# Altium schematic sheet MCUPower.SchDoc
size A3; SheetNumber: 3; SheetTotal: 6
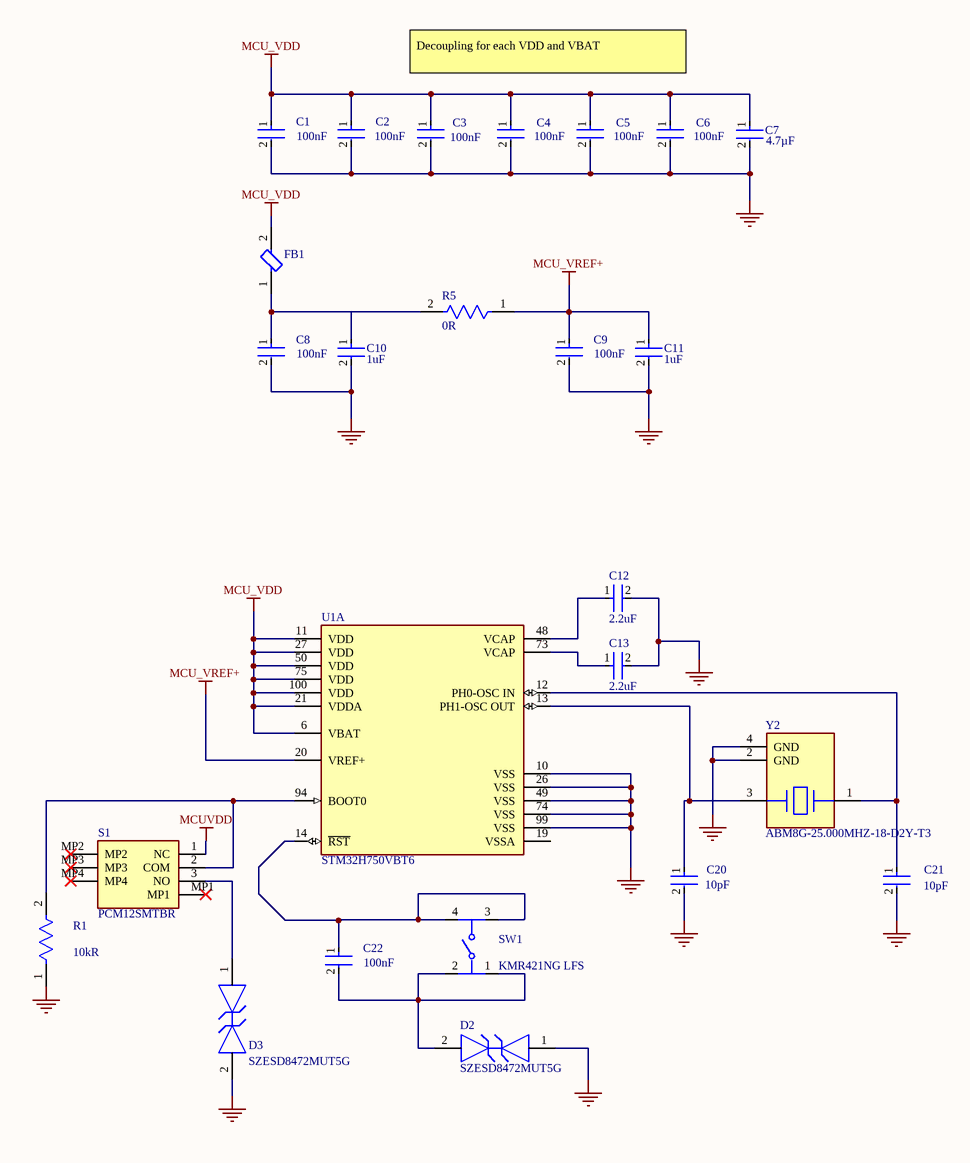
[diagram p0: MCUPower.SchDoc]

## Parts
C1  Capacitance: 100nF  [FP-GCM155-0_05-IPC_A]  (hidden comment: GCM155R71H104ME02J)
C2  Capacitance: 100nF  [FP-GCM155-0_05-IPC_A]  (hidden comment: GCM155R71H104ME02J)
C3  Capacitance: 100nF  [FP-GCM155-0_05-IPC_A]  (hidden comment: GCM155R71H104ME02J)
C4  Capacitance: 100nF  [FP-GCM155-0_05-IPC_A]  (hidden comment: GCM155R71H104ME02J)
C5  Capacitance: 100nF  [FP-GCM155-0_05-IPC_A]  (hidden comment: GCM155R71H104ME02J)
C6  Capacitance: 100nF  [FP-GCM155-0_05-IPC_A]  (hidden comment: GCM155R71H104ME02J)
C7  Capacitance: 4.7µF  [FP-GCM155-0_2-MFG]  (hidden comment: GCM155M8EB475ME08D)
C8  Capacitance: 100nF  [FP-GCM155-0_05-IPC_A]  (hidden comment: GCM155R71H104ME02J)
C9  Capacitance: 100nF  [FP-GCM155-0_05-IPC_A]  (hidden comment: GCM155R71H104ME02J)
C10  Capacitance: 1uF  [FP-GCM155-0_2-MFG]  (hidden comment: GCM155C71A105KE38D)
C11  Capacitance: 1uF  [FP-GCM155-0_2-MFG]  (hidden comment: GCM155C71A105KE38D)
C12  Capacitance: 2.2uF  [FP-GCH188-0_1-e0_2_0_5-MFG]  (hidden comment: GCM188C71A225KE02D)
C13  Capacitance: 2.2uF  [FP-GCH188-0_1-e0_2_0_5-MFG]  (hidden comment: GCM188C71A225KE02D)
C20  Capacitance: 10pF  [FP-GCM155-0_05-IPC_B]  (hidden comment: GCM1555G1H100GA16D)
C21  Capacitance: 10pF  [FP-GCM155-0_05-IPC_B]  (hidden comment: GCM1555G1H100GA16D)
C22  Capacitance: 100nF  [FP-GCM155-0_05-IPC_A]  (hidden comment: GCM155R71H104ME02J)
D2  SZESD8472MUT5G  [FP-152AF-MFG]
D3  SZESD8472MUT5G  [FP-152AF-MFG]
FB1  BLM15BX102SZ1D  [FP-BLM15-0_05-MFG]  (value not drawn)
R1  Resistance: 10kR  [FP-RC0402-0_4-IPC_A]  (hidden comment: RC0402FR-1310KL)
R5  Resistance: 0R  [FP-RMCF0402-MFG]  (hidden comment: RMCF0402ZT0R00)
S1  PCM12SMTBR  [PCM12SMTBR]
SW1  KMR421NG LFS  [FP-KMR421NG_LFS-MFG]
U1  STM32H750VBT6  [FP-LQFP100-1L-MFG]  (part A of 3)
Y2  ABM8G-25.000MHZ-18-D2Y-T3  [FP-ABM8G-MFG]

## Nets
GND: C1.2 C2.2 C3.2 C4.2 C5.2 C6.2 C7.2 C8.2 C9.2 C10.2 C11.2 C12.2 C13.2 C20.2 C21.2 D2.1 D3.2 R1.1 U1.10(VSS) U1.26(VSS) U1.49(VSS) U1.74(VSS) U1.99(VSS) Y2.2(GND) Y2.4(GND)
MCU_VDD: C1.1 C2.1 C3.1 C4.1 C5.1 C6.1 C7.1 FB1.2 U1.6(VBAT) U1.11(VDD) U1.21(VDDA) U1.27(VDD) U1.50(VDD) U1.75(VDD) U1.100(VDD)
MCU_VREF+: C9.1 C11.1 R5.1 U1.20(VREF+)
MCUVDD: S1.1(NC)
NetC8_1: C8.1 C10.1 FB1.1 R5.2
NetC12_1: C12.1 U1.48(VCAP)
NetC13_1: C13.1 U1.73(VCAP)
NetC20_1: C20.1 U1.13(PH1-OSC_OUT) Y2.3
NetC21_1: C21.1 U1.12(PH0-OSC_IN) Y2.1
NetC22_1: C22.1 SW1.3 SW1.4 U1.14(~{RST})
NetC22_2: C22.2 D2.2 SW1.1 SW1.2
NetD3_1: D3.1 S1.3(NO)
NetR1_2: R1.2 S1.2(COM) U1.94(BOOT0)

Not connected (* = marked no-connect by the designer): S1 MP1* MP2* MP3* MP4*; U1 19(VSSA)

## Notes on the sheet
- Decoupling for each VDD and VBAT

## Library data of the parts
C1-C6 C8 C9 C22 = CMP-06035-028957-1: Ceramic Capacitor for Automotive 100nF ±20% 50VDC X7R 0402 Paper T/R
C7 = CMP-00260-135863760-1: GCM155M8EB475ME08D Chip MultilayerCeramicCapacitors; Tolerance: 20%; Voltage Rating: 4V; Height: 700µm; Case/Package: 0402; NexarPartId: 135863760; Max Operating Temperature: 150°C; Material: Ceramic; Min Operating Temperature: -55°C; Lifecycle Status: Production
C10 C11 = CMP-06035-048986-1: CAP CER 1UF 10V X7S 0402; Tolerance: 10%; Min Operating Temperature: -55°C; Dielectric: X7S; Packaging: Tape and Reel; Ratings: AEC-Q200; Case Code (Metric): 1005; Max Operating Temperature: 125°C; Lead Free: Lead Free; Voltage Rating: 10V; Mount: Surface Mount; Width: 0.02inch; Depth: 0.5mm; Case/Package: 0402; Thickness: 0.022inch; Length: 0.039inch; Case Code (Imperial): 0402
C12 C13 = CMP-00260-57357036-1: GCM188C71A225KE02D Multilayer Ceramic Capacitor, 2.2 uF, 10 V, ± 10%, X7S, 0603 [1608 Metric]; NexarPartId: 57357036; RoHS: Non-Compliant; Lifecycle Status: Production
C20 C21 = CMP-06035-053638-1: Ceramic Capacitor for Automotive 10pF ±2% 50VDC X8G 0402 Paper T/R
D2 D3 = CMP-07200-000010-1: TVS DIODE 5.3V 14V 2X3DFN; Number of Bidirectional Channels: 1; Element Configuration: Single; Capacitance: 0.3pF; Peak Pulse Current: 3A; Power Line Protection: No; Min Breakdown Voltage: 7V; Direction: Bidirectional; Case/Package: DFN; Lead Free: Lead Free; Reverse Standoff Voltage: 5.3V; Clamping Voltage: 14V; Resistor Type: Zener; Packaging: Tape and Reel; Mount: Surface Mount; Number of Pins: 2; Max Operating Temperature: 150°C; Min Operating Temperature: -55°C; Working Voltage: 5.3V; RoHS Compliant: Yes
FB1 = CMP-06046-001231-1: Chip Ferrite Bead, 0402, 1000Ω @ 100MHz, 0.65Ω, 25%, 300mA
R1 = CMP-2002-07854-2: RESISTOR 0402 10K 1%; Power Rating: 62.5mW; Voltage Rating (DC): 50V; Temperature Coefficient: 100ppm/°C; REACH SVHC: No SVHC; Case/Package: 0402; Termination: SMD/SMT; Max Operating Temperature: 155°C; Contact Plating: Tin; Resistance Tolerance: 1%; Radiation Hardening: No; Voltage Rating: 50V; Lead Free: Lead Free; Length: 1mm; Depth: 0.5mm; Number of Pins: 2; RoHS Compliant: Yes; Case Code (Imperial): 0402; Case Code (Metric): 1005; Min Operating Temperature: -55°C; Packaging: Tape and Reel; Technology: THICK FILM; Series: RC; Number of Terminations: 2; Resistor Type: Thick Film; Tolerance: 1%; Working Voltage: 50V; Military Standard: Not; Construction: Rectangular
R5 = CMP-26527-007617-1: RES 0 OHM JUMPER 1/16W 0402; Power Rating: 63mW; Working Voltage: 50V; Current Rating: 1A; Series: RMCF; RoHS Compliant: Yes; Features: Automotive AEC-Q200; Width: 0.02inch; Depth: 0.5mm; Resistor Type: Thick Film; Number of Terminations: 2; Radiation Hardening: No; Length: 0.039inch; Contact Plating: Tin; Case/Package: 0402; Min Operating Temperature: -55°C; Case Code (Metric): 1005; Construction: Rectangular; Mount: Surface Mount; Max Operating Temperature: 155°C; Max Power Dissipation: 63mW; Height: 0.016inch; Lead Free: Lead Free; Packaging: Tape and Reel; Technology: THICK FILM; Case Code (Imperial): 0402; Military Standard: Not
S1 = PCM12SMTBR: Switch; Manufacturer_Name: C & K COMPONENTS; Datasheet Link: https://www.ckswitches.com/media/1424/pcm.pdf; Height: 1.4mm; Manufacturer_Part_Number: PCM12SMTBR; Mouser Part Number: 611-PCM12SMTBR; Mouser Price/Stock: https://www.mouser.co.uk/ProductDetail/CK/PCM12SMTBR?qs=By6Nw2ByBD1OEOnWcdZb2g%3D%3D; Arrow Part Number: PCM12SMTBR; Arrow Price/Stock: https://www.arrow.com/en/products/pcm12smtbr/ck?utm_currency=USD&region=europe
SW1 = CMP-10040-000003-1: SWITCH TACTILE SPST-NO 0.05A 32V; Manufacturer: C&K Components; Contact Resistance: 100mΩ; Operating Force: 2N; Current Rating: 50mA; Electromechanical Life: 100000Cycles; ComponentLink2URL: https://www.ckswitches.com/media/1480/kmr4.pdf; Automotive: No; Device Class L2: Switches; Temperature Range Low: -40°C; Temperature: -40°C to +85°C; Digikey Description: SWITCH TACTILE SPST-NO 0.05A 32V; Category: Switch; ComponentLink2Description: Datasheet; Octopart: https://octopart.com/kmr421nglfs-c%26k+components-7226706; Mouser Description: Switch Tactile N.O. SPST Round Button Gull Wing 0.05A 32VDC 1VA 2N SMD Automotive T/R; Package: KMR421NG LFS; Manufacturer Part Number: KMR421NG LFS; Lead Free: Yes; Throw Configuration: SPST-NO; Height: 2.5mm; Device Class L3: Tactile Switches; Mount: Surface Mount; Device Class L1: Electromechanical; RoHS: TRUE; Temperature Range High: +85°C; Voltage Rating Dc: 32V
U1 = CMP-12105-000017-1: IC MCU 32BIT 128KB FLASH 100LQFP; Manufacturer: STMicroelectronics; Number Of Uart Channels: 9; Number Of I/Os: 82; Max Junction Temp: +125°C; Data Bus Width: 32bits; Ram Size: 1MBytes; Min Supply Voltage: 1.62V; Number Of Spi Channels: 6; Number Of Adc Channels: 36; Max Supply Voltage: 3.6V; Standoff Height: 0.05mm; Interface: I2C,SPI,UART,USART,CAN,USB,LIN,IrDA,Ethernet,I2S,Other; Number Of A/D Converters: 3; Number Of I2C Channels: 4; Memory Size: 128KBytes; Frequency: 480MHz; Number Of Timers/Counters: 20; Number Of Ethernet Channels: 1; Core Architecture: ARM Cortex-M7; Number Of Usb Channels: 2; Number Of Pwm Channels: 42; Ambient Temperature Range High: +85°C; Temperature: -40°C to +125°C; ComponentLink2URL: https://www.st.com/resource/en/datasheet/stm32h750vb.pdf; Device Class L2: Embedded Processors and Controllers; Temperature Range Low: -40°C; Octopart: https://octopart.com/stm32h750vbt6-stmicroelectronics-94048547; Category: IC; Manufacturer Part Number: STM32H750VBT6; Height: 1.6mm; Lead Free: Yes; Device Class L1: Integrated Circuits (ICs); Digikey Description: IC MCU 32BIT 128KB FLASH 100LQFP; RoHS: TRUE; Ambient Temperature Range Low: -40°C; Device Class L3: Microcontrollers; ComponentLink2Description: Datasheet; Mouser Description: MCU 32-Bit STM32H750VB ARM Cortex M7 RISC 128KB Flash 1.8V/2.5V/3.3V 100-Pin LQFP Tray; Number Of Cores: 1; Automotive: No; Memory Type: FLASH; Package: LQFP100-1L; Temperature Range High: +125°C
Y2 = CMP-27762-015132-1: Crystal 25MHz ±20ppm (Tol) ±30ppm (Stability) 18pF FUND 60Ω 4-Pin SMD T/R; ESR (Equivalent Series Resistance): 60R; Termination: SMD/SMT; Series: ABM8G; Max Operating Temperature: 85°C; Width: 2.5mm; Radiation Hardening: No; Mount: Surface Mount; Package Quantity: 3000; Frequency Stability: 30ppm; Min Operating Temperature: -40°C; Packaging: Tape and Reel; Number of Pins: 4; Frequency: 25MHz; Height: 0.039inch; Tolerance: 20ppm; Length: 3.2mm; Frequency Tolerance: 20ppm; Series Resistance: 60R; Depth: 2.5mm; Case/Package: SMD/SMT; Load Capacitance: 18pF